# Altium schematic sheet signals.SchDoc
size A4
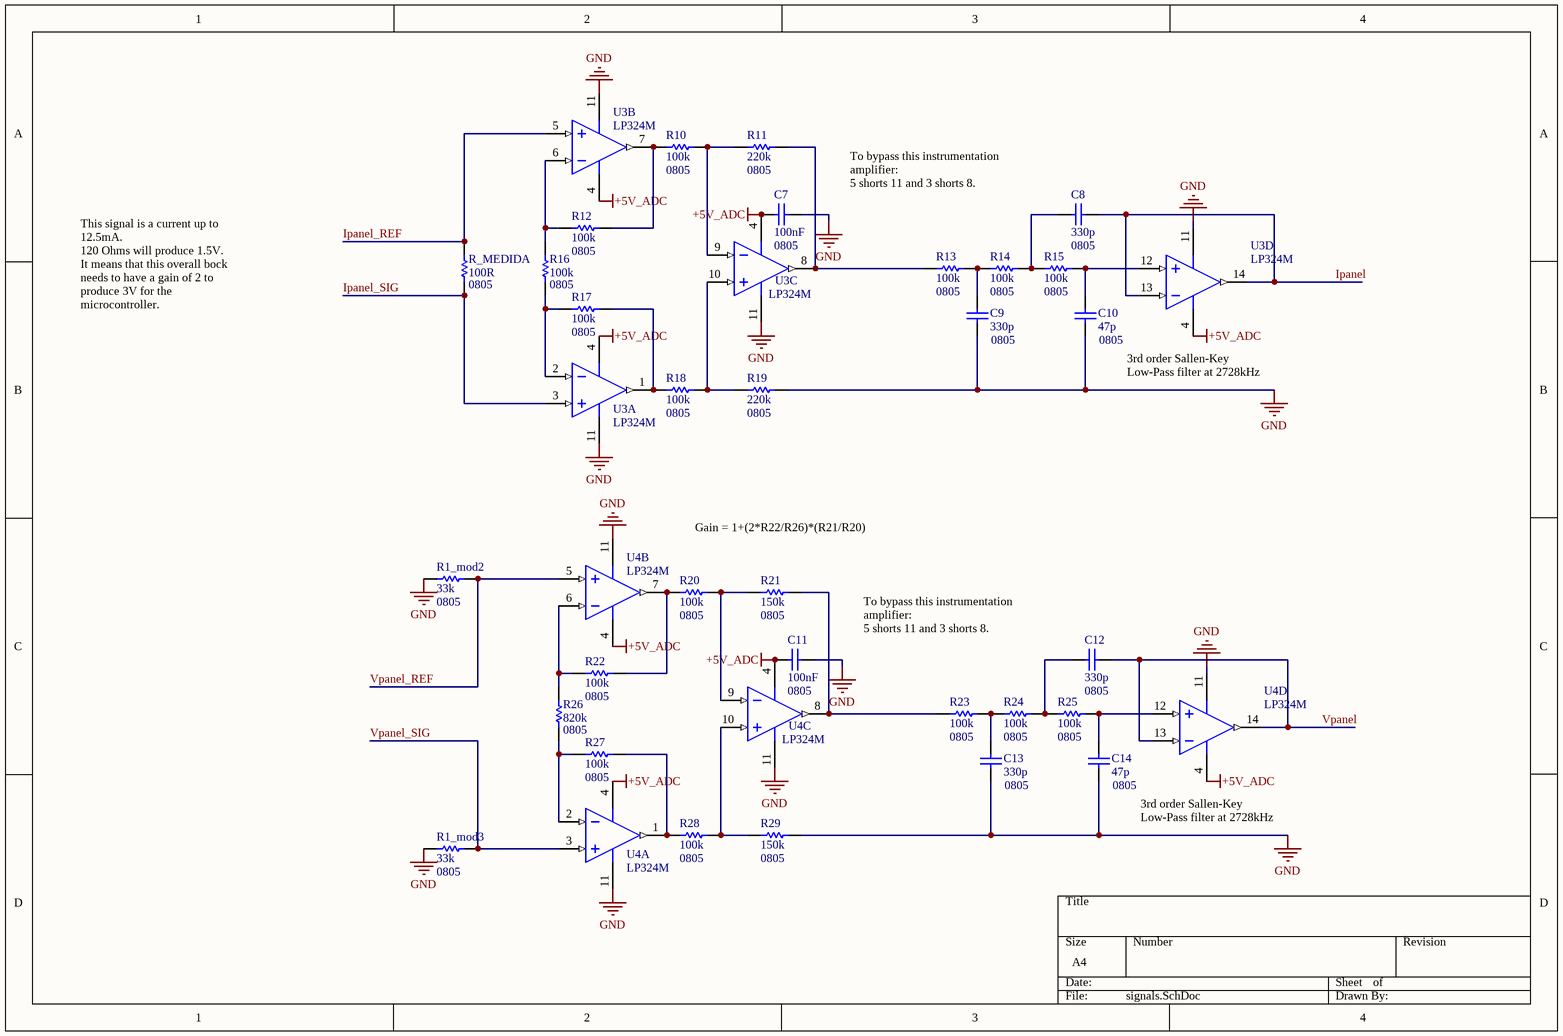
[diagram p0: signals.SchDoc]

## Parts
C7  100nF  Footprint: 0805  [0805C]
C8  330p  Footprint: 0805  [0805C]
C9  330p  Footprint: 0805  [0805C]
C10  47p  Footprint: 0805  [0805C]
C11  100nF  Footprint: 0805  [0805C]
C12  330p  Footprint: 0805  [0805C]
C13  330p  Footprint: 0805  [0805C]
C14  47p  Footprint: 0805  [0805C]
R1_mod2  33k  Type: 0805  [0805R]
R1_mod3  33k  Type: 0805  [0805R]
R10  100k  Type: 0805  [0805R]
R11  220k  Type: 0805  [0805R]
R12  100k  Type: 0805  [0805R]
R13  100k  Type: 0805  [0805R]
R14  100k  Type: 0805  [0805R]
R15  100k  Type: 0805  [0805R]
R16  100k  Type: 0805  [0805R]
R17  100k  Type: 0805  [0805R]
R18  100k  Type: 0805  [0805R]
R19  220k  Type: 0805  [0805R]
R20  100k  Type: 0805  [0805R]
R21  150k  Type: 0805  [0805R]
R22  100k  Type: 0805  [0805R]
R23  100k  Type: 0805  [0805R]
R24  100k  Type: 0805  [0805R]
R25  100k  Type: 0805  [0805R]
R26  820k  Type: 0805  [0805R]
R27  100k  Type: 0805  [0805R]
R28  100k  Type: 0805  [0805R]
R29  150k  Type: 0805  [0805R]
R_MEDIDA  100R  Type: 0805  [0805R]
U3  LP324M  [SOIC14-150(50)]  (parts A,B,C,D of 4)
U4  LP324M  [SOIC14-150(50)]  (parts A,B,C,D of 4)

## Nets
+5V_ADC: C7.2 C11.2 U3.4(V+) U4.4(V+)
GND: C7.1 C9.1 C10.1 C11.1 C13.1 C14.1 R1_mod2.2 R1_mod3.2 R19.1 R29.1 U3.11(GND) U4.11(GND)
Ipanel: C8.1 U3.13(IN4-) U3.14(OUT4)
Ipanel_REF: R_MEDIDA.2 U3.5(IN2+)
Ipanel_SIG: R_MEDIDA.1 U3.3(IN1+)
Vpanel: C12.1 U4.13(IN4-) U4.14(OUT4)
Vpanel_REF: R1_mod2.1 U4.5(IN2+)
Vpanel_SIG: R1_mod3.1 U4.3(IN1+)
NetC8_2: C8.2 R14.1 R15.2
NetC9_2: C9.2 R13.1 R14.2
NetC10_2: C10.2 R15.1 U3.12(IN4+)
NetC12_2: C12.2 R24.1 R25.2
NetC13_2: C13.2 R23.1 R24.2
NetC14_2: C14.2 R25.1 U4.12(IN4+)
NetR10_1: R10.1 R11.2 U3.9(IN3-)
NetR10_2: R10.2 R12.1 U3.7(OUT2)
NetR11_1: R11.1 R13.2 U3.8(OUT3)
NetR12_2: R12.2 R16.2 U3.6(IN2-)
NetR16_1: R16.1 R17.2 U3.2(IN1-)
NetR17_1: R17.1 R18.2 U3.1(OUT1)
NetR18_1: R18.1 R19.2 U3.10(IN3+)
NetR20_1: R20.1 R21.2 U4.9(IN3-)
NetR20_2: R20.2 R22.1 U4.7(OUT2)
NetR21_1: R21.1 R23.2 U4.8(OUT3)
NetR22_2: R22.2 R26.2 U4.6(IN2-)
NetR26_1: R26.1 R27.2 U4.2(IN1-)
NetR27_1: R27.1 R28.2 U4.1(OUT1)
NetR28_1: R28.1 R29.2 U4.10(IN3+)

## Notes on the sheet
- To bypass this instrumentation amplifier:
  5 shorts 11 and 3 shorts 8.
- This signal is a current up to 12.5mA.
  120 Ohms will produce 1.5V.
  It means that this overall bock needs to have a gain of 2 to produce 3V for the microcontroller.
- 3rd order Sallen-Key Low-Pass filter at 2728kHz
- Gain = 1+(2*R22/R26)*(R21/R20)

## Library data of the parts
C7-C14 = Cap: Capacitor; Type: smd
  C7 C11: Value: 100nF
  C8 C9 C12 C13: Value: 330p
  C10 C14: Value: 47p
R1_mod2 R1_mod3 R10-R29 R_MEDIDA = Res1: Resistor
  R1_mod2 R1_mod3: Value: 33k
  R10 R12-R18 R20 R22-R25 R27 R28: Value: 100k
  R11 R19: Value: 220k
  R21 R29: Value: 150k
  R26: Value: 820k
  R_MEDIDA: Value: 100R
U3 U4 = LP324M: Micropower Quad Operational Amplifier; Type: smd